# Altium project Krapong-ROV.PrjPcb
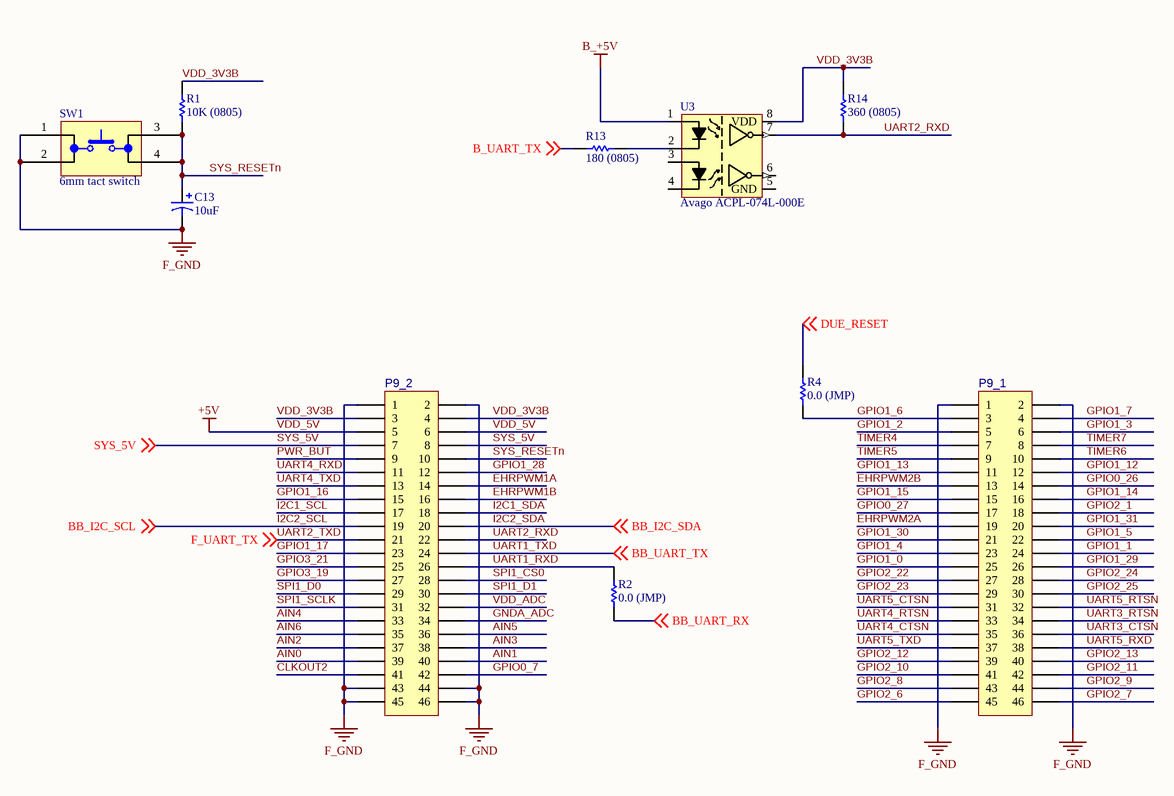
[diagram p0: BBB_Cape.SchDoc]
4 sheets, 45 parts. Net scope: global (net labels, ports and power ports of the same name join across sheets).
Sheets:
  BBB_Cape.SchDoc
  Power.SchDoc
  Interface.SchDoc
  DUE_Shield.SchDoc

## Sheet BBB_Cape.SchDoc: Krapong-ROV, F-Tube (BBB)
size A4; DocumentNumber: 1; Revision: 1.0; SheetNumber: 2; SheetTotal: 4; PageSetup: Record=PageOptions|CenterHorizontal=True|CenterVertical=True|PrintScale=0.97|XCorrection=1.00|YCorrection=1.00|PrintKind=0|BorderSize=5000000|LeftOffset=0|BottomOffset=0|Orientation=2|PaperLength=1000|PaperWidth=1000|Scale=100|PaperSource=7|PrintQuality=-3|MediaType=1|DitherType=10|PrintScaleMode=1|PaperKind=A4|PaperIndex=9; Rule: PcbType=ProtelPcb

### Parts
C13  10uF  [PCB-ibkib54e90xysjsqnert-1]
P9_1  Major League Electronics TSHC-123-D-06-240-GT-LF  [PCB-44amy4d7xro60oo8ojyx-1]  (value not drawn)
P9_2  Major League Electronics TSHC-123-D-06-240-GT-LF  [PCB-44amy4d7xro60oo8ojyx-1]  (value not drawn)
R1  10K (0805)  [RESC2013X60X40NL15T20]
R2  0.0 (JMP)  [RESC2013X60X35ML10T20]
R4  0.0 (JMP)  [RESC2013X60X35ML10T20]
R13  180 (0805)  [RESC2013X60X40NL15T20]
R14  360 (0805)  [RESC2013X60X40NL15T20]
SW1  6mm tact switch  [PCB-gaic1pl4705ifv3nefaq-1]
U3  Avago ACPL-074L-000E  [PCB-tvxoajnlj650fdg499ex-1]

### Nets
B_+5V: U3.1
F_GND: C13.2 P9_1.1 P9_1.2 P9_2.1 P9_2.2 P9_2.43 P9_2.44 P9_2.45 P9_2.46 SW1.1 SW1.2
VDD_5V: P9_2.5 P9_2.6  [also labelled +5V]
AIN0: P9_2.39
AIN1: P9_2.40
AIN2: P9_2.37
AIN3: P9_2.38
AIN4: P9_2.33
AIN5: P9_2.36
AIN6: P9_2.35
B_UART_TX: R13.2 ; off-sheet B_UART_TX
BB_UART_RX: R2.1 ; off-sheet BB_UART_RX
CLKOUT2: P9_2.41
DUE_RESET: R4.2 ; off-sheet DUE_RESET
EHRPWM1A: P9_2.14
EHRPWM1B: P9_2.16
EHRPWM2A: P9_1.19
EHRPWM2B: P9_1.13
GNDA_ADC: P9_2.34
GPIO0_7: P9_2.42
GPIO0_26: P9_1.14
GPIO0_27: P9_1.17
GPIO1_0: P9_1.25
GPIO1_1: P9_1.24
GPIO1_2: P9_1.5
GPIO1_3: P9_1.6
GPIO1_4: P9_1.23
GPIO1_5: P9_1.22
GPIO1_6: P9_1.3 R4.1
GPIO1_7: P9_1.4
GPIO1_12: P9_1.12
GPIO1_13: P9_1.11
GPIO1_14: P9_1.16
GPIO1_15: P9_1.15
GPIO1_16: P9_2.15
GPIO1_17: P9_2.23
GPIO1_28: P9_2.12
GPIO1_29: P9_1.26
GPIO1_30: P9_1.21
GPIO1_31: P9_1.20
GPIO2_1: P9_1.18
GPIO2_6: P9_1.45
GPIO2_7: P9_1.46
GPIO2_8: P9_1.43
GPIO2_9: P9_1.44
GPIO2_10: P9_1.41
GPIO2_11: P9_1.42
GPIO2_12: P9_1.39
GPIO2_13: P9_1.40
GPIO2_22: P9_1.27
GPIO2_23: P9_1.29
GPIO2_24: P9_1.28
GPIO2_25: P9_1.30
GPIO3_19: P9_2.27
GPIO3_21: P9_2.25
I2C1_SCL: P9_2.17
I2C1_SDA: P9_2.18
I2C2_SCL: P9_2.19 ; off-sheet BB_I2C_SCL  [also labelled BB_I2C_SCL]
I2C2_SDA: P9_2.20 ; off-sheet BB_I2C_SDA  [also labelled BB_I2C_SDA]
PWR_BUT: P9_2.9
SPI1_CS0: P9_2.28
SPI1_D0: P9_2.29
SPI1_D1: P9_2.30
SPI1_SCLK: P9_2.31
SYS_5V: P9_2.7 P9_2.8 ; off-sheet SYS_5V
SYS_RESETn: C13.1 P9_2.10 R1.1 SW1.3 SW1.4
TIMER4: P9_1.7
TIMER5: P9_1.9
TIMER6: P9_1.10
TIMER7: P9_1.8
UART1_RXD: P9_2.26 R2.2
UART1_TXD: P9_2.24 ; off-sheet BB_UART_TX  [also labelled BB_UART_TX]
UART2_RXD: P9_2.22 R14.2 U3.7
UART2_TXD: P9_2.21 ; off-sheet F_UART_TX  [also labelled F_UART_TX]
UART3_CTSN: P9_1.36
UART3_RTSN: P9_1.34
UART4_CTSN: P9_1.35
UART4_RTSN: P9_1.33
UART4_RXD: P9_2.11
UART4_TXD: P9_2.13
UART5_CTSN: P9_1.31
UART5_RTSN: P9_1.32
UART5_RXD: P9_1.38
UART5_TXD: P9_1.37
VDD_3V3B: P9_2.3 P9_2.4 R1.2 R14.1 U3.8(VDD)
VDD_ADC: P9_2.32
NetR13_1: R13.1 U3.2

Not connected (* = marked no-connect by the designer): U3 3 4 5(GND) 6

### Notes on the sheet
- Title
- Size:
- Date:
- A4
- Number:
- Time:
- Revision:
- Sheet
- of
- Designer:
- Siwakorn Sukprasertchai
- Marine Electrical Laboratory
- IMS, KU SRC
- File:

### Library data of the parts
C13 = CMP-da8810cd3d6e054f-2: Capacitor Alum Elec, 10uf, 100v, 20%, Capacitor Alum Elec, 10uf, 100v, 20%, Smd, Full Reel; Manufacturer Part Number: EEE-2AA100UP; Capacitance: 10.0 µF; Lead-Free Status: Lead Free; RoHS: Compliant; Octopart URL: http://octopart.com/eee-2aa100up-panasonic-55558784; Lifecycle Status: Not Listed by Manufacturer; Capacitance Tolerance: ±20%; Packaging: Cut Tape (CT); Mounting Style: Surface Mount; Size-Height: 6.20 mm; Voltage Rating (DC): 100 V; REACH SVHC Compliance: No SVHC; Size-Diameter: 8.00 mm; OctopartID: da8810cd3d6e054f
P9_1 P9_2 = CMP-5fc8970d5e37800f-3: TSHC series 46 position 2.54 mm straight Thru Hole Connector; Lead-Free Status: Lead Free; Octopart URL: http://octopart.com/tshc-123-d-06-240-gt-lf-major+league+electronics-30352537; OctopartID: 5fc8970d5e37800f; Manufacturer Part Number: TSHC-123-D-06-240-GT-LF; RoHS: Compliant
R1 R13 R14 = CMP-1860549-2: RES SMD 10K OHM 1% 1/3W 0805; Lead-Free Status: Lead Free; Power Rating: 0.125 W; Resistance: 10000.0 ?; Voltage Rating (DC): 150.0 V; Case/Package: 0805; Mounting Style: Surface Mount; Number of Pins: 2; Octopart Url: https://octopart.com/crcw080510k0fkeahp-vishay-42634554; OctopartID: fa6931e9523525ae; Packaging: Cut Tape (CT); REACH SVHC Compliance: No SVHC; Resistance Tolerance: ±1%; RoHS: Compliant
R2 R4 = CMP-1875921-8: Res Thick Film 0805 0 Ohm Molded SMD Paper T/R; Manufacturer Part Number: RC0805FR-070RL; Resistance: 0.0 ?; Lead-Free Status: Lead Free; Resistance Tolerance: ±1%; OctopartID: f3d13a5618eb2c16; Case/Package: 0805; Octopart Url: https://octopart.com/rc0805fr-070rl-yageo-9293404; Mounting Style: Surface Mount; RoHS: Compliant
SW1 = CMP-3ee8f78971b1e12f-10: Switch Tactile OFF (ON) SPST Round Button PC Pins 0.05A 24VDC 100000Cycles 1.57N Thru-Hole Loose; Manufacturer Part Number: 1825910-6; ELV Compliant: Compliant; Lead-Free Status: Lead Free; Contact Plating: Silver; Contact Material: Copper Alloy; Lifecycle Status: Active; Mounting Style: Through Hole; Octopart URL: http://octopart.com/1825910-6-te+connectivity+%2F+amp-7039551; OctopartID: 3ee8f78971b1e12f; RoHS: Compliant
U3 = CMP-ee2b274cae1231ec-3: Optocoupler Logic-Out Push-Pull DC-IN 2-CH 8-Pin SOIC Tube; Lead-Free Status: Lead Free; Output Voltage: 6.50 V; Input Current: 18.0 mA; Isolation Voltage: 3.75 kV; Number of Pins: 8; Packaging: Tube; Octopart URL: http://octopart.com/acpl-074l-000e-avago-7169375; Manufacturer Part Number: ACPL-074L-000E; REACH SVHC Compliance: No SVHC; Lifecycle Status: Active; RoHS: Compliant; Mounting Style: Surface Mount; OctopartID: ee2b274cae1231ec

## Sheet Power.SchDoc: Krapong-ROV, F-Tube (Power)
size A4; Author: Siwakorn Sukprasertchai; Engineer: Siwakorn Sukprasertchai; Organization: Author:; Address1: Siwakorn Sukprasertchai; Address3: Electrical Laboratory; Address4: IMS, KU SRC; DocumentNumber: 2; Revision: 1.0; SheetNumber: 1; SheetTotal: 4; PageSetup: Record=PageOptions|CenterHorizontal=True|CenterVertical=True|PrintScale=0.97|XCorrection=1.00|YCorrection=1.00|PrintKind=0|BorderSize=5000000|LeftOffset=0|BottomOffset=0|Orientation=2|PaperLength=1000|PaperWidth=1000|Scale=100|PaperSource=7|PrintQuality=-3|MediaType=1|DitherType=10|PrintScaleMode=1|PaperKind=A4|PaperIndex=9
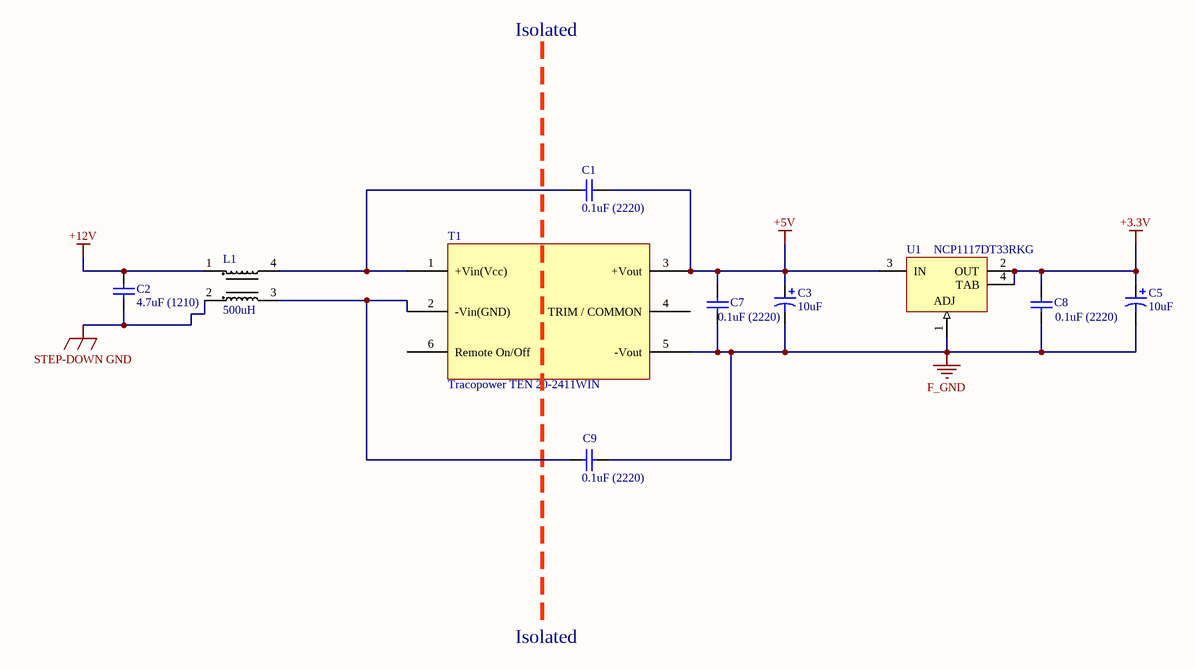
[diagram p1: Power.SchDoc]

### Parts
C1  0.1uF (2220)  [PCB-vinf2si7ml1r5i2zfsci-1]
C2  4.7uF (1210)  [PCB-2fbb0vau3p468w0y920g-1]
C3  10uF  [PCB-ibkib54e90xysjsqnert-1]
C5  10uF  [PCB-ibkib54e90xysjsqnert-1]
C7  0.1uF (2220)  [PCB-vinf2si7ml1r5i2zfsci-1]
C8  0.1uF (2220)  [PCB-vinf2si7ml1r5i2zfsci-1]
C9  0.1uF (2220)  [PCB-vinf2si7ml1r5i2zfsci-1]
L1  500uH  [PCB-kl08ucybfpyhun58dexm-1]
T1  Tracopower TEN 20-2411WIN  [PCBComponent_1]
U1  NCP1117DT33RKG  [PCB-1493942-1]

### Nets
+3.3V: C5.1 C8.1 U1.2(OUT) U1.4(TAB)
+5V: C1.1 C3.1 C7.1 T1.3(+Vout) U1.3(IN)  [project net VDD_5V]
+12V: C2.2 L1.1
F_GND: C3.2 C5.2 C7.2 C8.2 C9.1 T1.5(-Vout) U1.1(ADJ)
STEP-DOWN GND: C2.1 L1.2  [project net -PWL (0V)]
NetC1_2: C1.2 L1.4 T1.1(+Vin(Vcc))
NetC9_2: C9.2 L1.3 T1.2(-Vin(GND))

Not connected (* = marked no-connect by the designer): T1 4(TRIM_/_COMMON) 6(Remote_On/Off)

### Notes on the sheet
- Isolated
- Title
- Size:
- Date:
- A4
- Number:
- Time:
- Revision:
- Sheet
- of
- Designer:
- Siwakorn Sukprasertchai
- Marine Electrical Laboratory
- IMS, KU SRC
- File:

### Library data of the parts
C1 C7-C9 = CMP-869a4f93a212595d-3: 2220 1 uF 250 V ±10% Tolerance X7R SMT Multilayer Ceramic Capacitor; Manufacturer Part Number: GRM55DR72E105KW01L; Voltage Rating (DC): 250.0 V; Capacitance: 1e-06 F; Lead-Free Status: Lead Free; Mounting Style: Surface Mount; Dielectric Characteristic: X7R; Number of Pins: 2; Digikey URL: http://www.digikey.com/product-detail/en/murata-electronics-north-america/GRM55DR72E105KW01L/490-3550-1-ND/789455; Size-Width: 0.005 m; Case/Package: 2220, 5750; REACH SVHC Compliance: No SVHC; Size-Height: 0.002 m; Packaging: Cut Tape (CT), Tape & Reel (TR); Capacitance Tolerance: ±10%; RoHS: Compliant; OctopartID: 869a4f93a212595d; Size-Length: 0.0057 m; Octopart URL: http://octopart.com/grm55dr72e105kw01l-murata-197102
C2 = Murata GRM32ER71H475KA88L-1: 1210 4.7 uF 50 V ±10% Tolerance X7R SMT Multilayer Ceramic Capacitor; Voltage Rating (DC): 50.0 V; Lead-Free Status: Lead Free; Capacitance: 4.7e-06 F; Case/Package (SI): 3225; Octopart URL: http://octopart.com/grm32er71h475ka88l-murata-196576; Manufacturer Part Number: GRM32ER71H475KA88L; Size-Height: 0.0025 m; Dielectric Characteristic: X7R; Size-Width: 0.0025 m; RoHS: Compliant; REACH SVHC Compliance: No SVHC; Mounting Style: Surface Mount; Capacitance Tolerance: ±10%; Packaging: Cut Tape (CT), Tape & Reel (TR); Size-Length: 0.0032 m; Size-Thickness: 0.0025 m; Lifecycle Status: Active; Case/Package: 1210; Number of Pins: 2; OctopartID: 8d884480570e524f
C3 C5 = CMP-da8810cd3d6e054f-2: as C13 on sheet BBB_Cape; RoHS: Compliant; Octopart URL: http://octopart.com/eee-2aa100up-panasonic-55558784; Lifecycle Status: Not Listed by Manufacturer; Capacitance Tolerance: ±20%; Packaging: Cut Tape (CT); Mounting Style: Surface Mount; Size-Height: 6.20 mm; Voltage Rating (DC): 100 V; REACH SVHC Compliance: No SVHC; Size-Diameter: 8.00 mm; OctopartID: da8810cd3d6e054f
L1 = CMP-c51a0edc807c1add-4: Common Mode Chokes Dual 1mH 10kHz 15A 3.3mOhm DCR Thru-Hole T/R; Manufacturer Part Number: 7448031501; Inductance: 1.00 mH; RoHS: Compliant; REACH SVHC Compliance: No SVHC; Mounting Style: Through Hole; Packaging: Bulk
T1 = CMP-cff406adefdb1033-7: 20 W Watt, 9-36VDCVin, Quad Output, 5V@4A General Purpose DC-DC Converter in standard 1 x 2; Isolation Voltage: 1.50 kV; Output Voltage: 5.00 V; Supply Voltage (DC): 24.0 V; Power Rating: 20.0 W; Number of Outputs: 1; Input Voltage (DC): 9.00 V to 36.0 V; Output Current: 4.00 A; Size-Width: 25.4 mm; Octopart URL: http://octopart.com/ten+20-2411win-tracopower-5440841; Manufacturer Part Number: TEN 20-2411WIN; OctopartID: cff406adefdb1033; Size-Height: 10.2 mm; REACH SVHC Compliance: No SVHC; Mounting Style: Through Hole; RoHS: Compliant
U1 = CMP-1493942-4: IC REG LDO 3.3V 1A DPAK; Current Rating: 1.0 A; Dropout Voltage: 1.2 V; Polarity: P-Channel; Number of Outputs: 1; Lead-Free Status: Lead Free; Mounting Style: Surface Mount; RoHS: Compliant; Octopart Url: https://octopart.com/ncp1117dt33rkg-on+semiconductor-538097; Case/Package: DPAK; OctopartID: 07a0cea21737d867; REACH SVHC Compliance: No SVHC; Lifecycle Status: Active; Number of Pins: 3; Packaging: Cut Tape (CT); Output Voltage: 3.3 V; Output Current: 1.0 A; Halogen Free Status: Halogen Free

## Sheet Interface.SchDoc: Krapong-ROV, F-Tube (Sensor, Interface)
size A4; DocumentNumber: 3; SheetNumber: 4; SheetTotal: 4; PageSetup: Record=PageOptions|CenterHorizontal=True|CenterVertical=True|PrintScale=0.97|XCorrection=1.00|YCorrection=1.00|PrintKind=0|BorderSize=5000000|LeftOffset=0|BottomOffset=0|Orientation=2|PaperLength=1000|PaperWidth=1000|Scale=100|PaperSource=7|PrintQuality=-3|MediaType=1|DitherType=10|PrintScaleMode=1|PaperKind=A4|PaperIndex=9
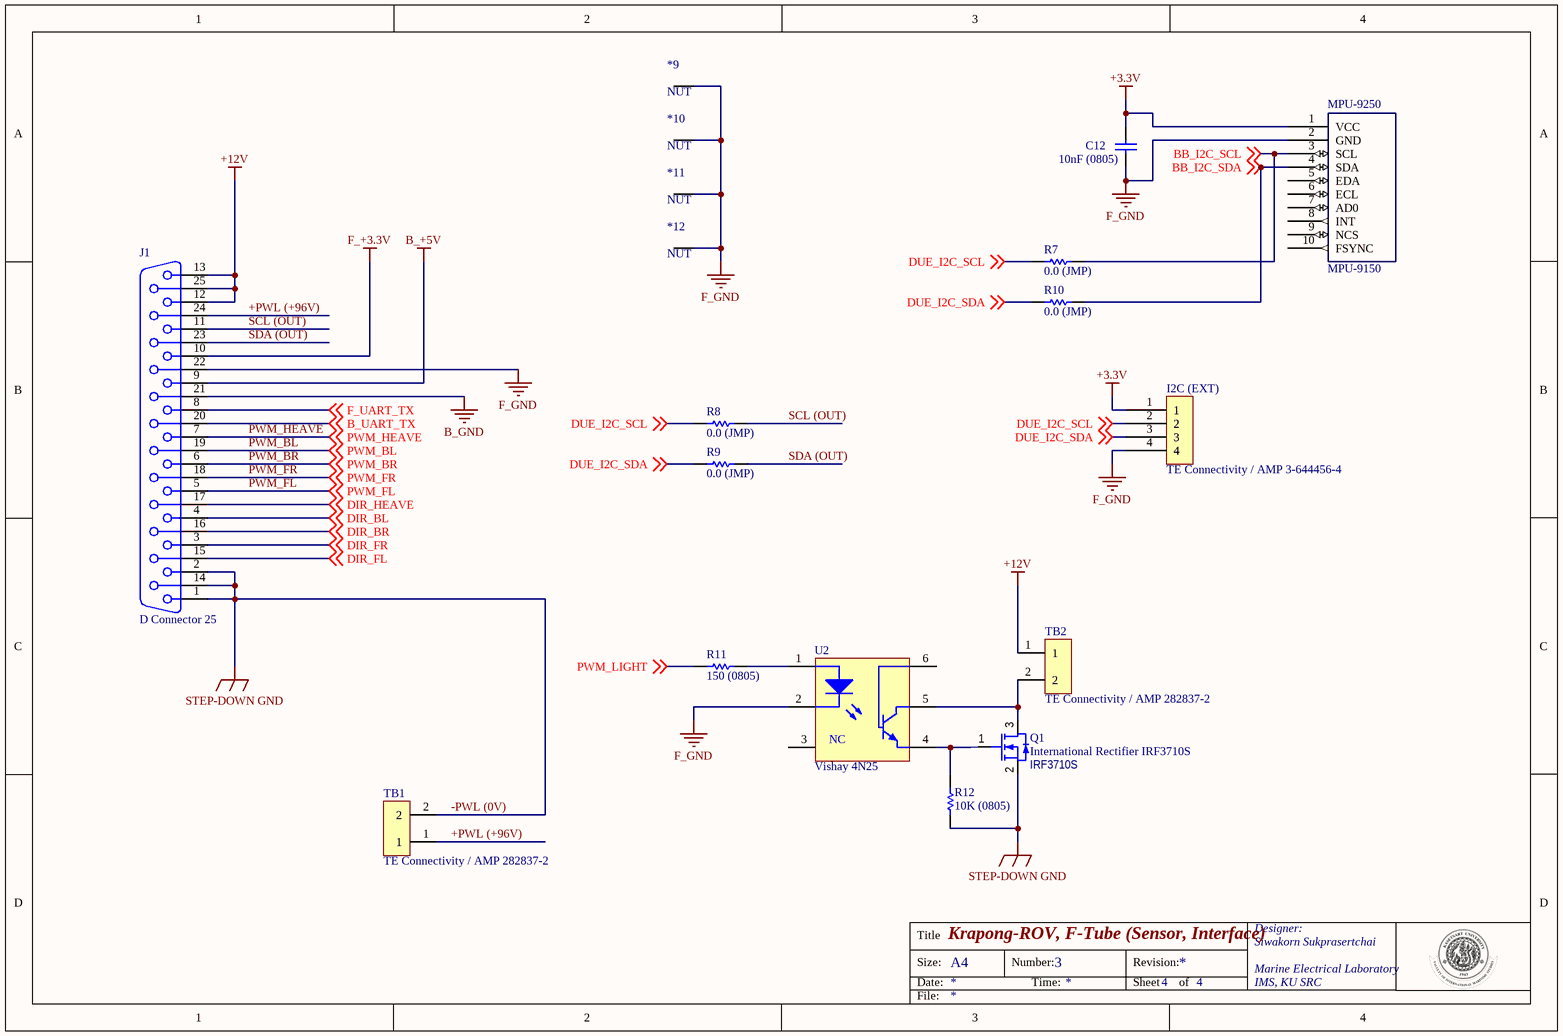
[diagram p2: Interface.SchDoc]

### Parts
*9  NUT  [PCB-pcj1l6roq5gpi9u538ps-1]
*10  NUT  [PCB-pcj1l6roq5gpi9u538ps-1]
*11  NUT  [PCB-pcj1l6roq5gpi9u538ps-1]
*12  NUT  [PCB-pcj1l6roq5gpi9u538ps-1]
C12  10nF (0805)  [CAPC2013X94X50NL20T25]
I2C_(EXT)  TE Connectivity / AMP 3-644456-4  [PCB-rz6n0fnwkrymh4bzf5j3-1]
J1  D Connector 25  [PCB-w6wyndea0hgjvu195v0z-1]
MPU-9250  MPU-9150  [PCB-qjnj89ydof8zhvyyt2pp-1]
Q1  International Rectifier IRF3710S  Vlaue: IRF3710S  [PCB-knfcvcmaqkz1jt91xuml-1]
R7  0.0 (JMP)  [RESC2013X60X35ML10T20]
R8  0.0 (JMP)  [RESC2013X60X35ML10T20]
R9  0.0 (JMP)  [RESC2013X60X35ML10T20]
R10  0.0 (JMP)  [RESC2013X60X35ML10T20]
R11  150 (0805)  [RESC2013X60X40NL15T20]
R12  10K (0805)  [RESC2013X60X40NL15T20]
TB1  TE Connectivity / AMP 282837-2  [PCB-suk0edwv8aq1tcw7107x-1]
TB2  TE Connectivity / AMP 282837-2  [PCB-suk0edwv8aq1tcw7107x-1]
U2  Vishay 4N25  [PCB-jnahbn6qvly565f94r9b-1]

### Nets
+3.3V: C12.2 I2C_(EXT).1 MPU-9250.1(VCC)
+12V: J1.12 J1.13 J1.25 TB2.1
-PWL (0V): J1.1 J1.2 J1.14 Q1.2(S) R12.1 TB1.2  [also labelled STEP-DOWN GND]
B_+5V: J1.9
B_GND: J1.21
F_+3.3V: J1.10
F_GND: *9.0 *10.0 *11.0 *12.0 C12.1 I2C_(EXT).4 J1.22 MPU-9250.2(GND) U2.2
+PWL (+96V): J1.24 TB1.1
B_UART_TX: J1.20 ; off-sheet B_UART_TX
BB_I2C_SCL: MPU-9250.3(SCL) R7.1 ; off-sheet BB_I2C_SCL  [project net I2C2_SCL]
BB_I2C_SDA: MPU-9250.4(SDA) R10.1 ; off-sheet BB_I2C_SDA  [project net I2C2_SDA]
DIR_BL: J1.4 ; off-sheet DIR_BL
DIR_BR: J1.16 ; off-sheet DIR_BR
DIR_FL: J1.15 ; off-sheet DIR_FL
DIR_FR: J1.3 ; off-sheet DIR_FR
DIR_HEAVE: J1.17 ; off-sheet DIR_HEAVE
DUE_I2C_SCL: I2C_(EXT).2 R7.2 R8.2 ; off-sheet DUE_I2C_SCL
DUE_I2C_SDA: I2C_(EXT).3 R9.2 R10.2 ; off-sheet DUE_I2C_SDA
F_UART_TX: J1.8 ; off-sheet F_UART_TX  [project net UART2_TXD]
PWM_BL: J1.19 ; off-sheet PWM_BL
PWM_BR: J1.6 ; off-sheet PWM_BR
PWM_FL: J1.5 ; off-sheet PWM_FL
PWM_FR: J1.18 ; off-sheet PWM_FR
PWM_HEAVE: J1.7 ; off-sheet PWM_HEAVE
PWM_LIGHT: R11.2 ; off-sheet PWM_LIGHT
SCL (OUT): J1.11 R8.1
SDA (OUT): J1.23 R9.1
NetQ1_1: Q1.1(G) R12.2 U2.4
NetQ1_3: Q1.3(D) TB2.2 U2.5
NetR11_1: R11.1 U2.1

Not connected (* = marked no-connect by the designer): MPU-9250 5(EDA) 6(ECL) 7(AD0) 8(INT) 9(NCS) 10(FSYNC); U2 3 6

### Notes on the sheet
- Title
- Size:
- Date:
- A4
- Number:
- Time:
- Revision:
- Sheet
- of
- Designer:
- Siwakorn Sukprasertchai
- Marine Electrical Laboratory
- IMS, KU SRC
- File:
- (in symbol CMP-1524877-3) NC

### Library data of the parts
*9-*12 = CMP-5ddc94dc62be821b-2: Standoff; 12 mm; M3 x 0.5; Brass; Hex; Nickel Plate; 8 in.; 8 in.; Manufacturer Part Number: 24314; Lead-Free Status: Lead Free; Size-Width: 5.00 mm; Octopart URL: http://octopart.com/24314-keystone-662020; OctopartID: 5ddc94dc62be821b; Size-Length: 12.0 mm; Material: Brass; RoHS: Compliant
C12 = CMP-16466678-5: CAP CER 10NF 50V 5% X7R 0805; Manufacturer Part Number: 08055C103JAT2A; Case/Package (SI): 2012; Capacitance: 1e-08 F; Voltage Rating (DC): 50.0 V; Dielectric Material: Ceramic Multilayer; Lead-Free Status: Lead Free; Insulation Resistance: 1e+11 ?; Size-Width: 0.0012446 m; REACH SVHC Compliance: No SVHC; Capacitance Tolerance: ±5%; Case/Package: 0805; Mounting Style: Surface Mount; Size-Thickness: 0.0009398 m; Dielectric Characteristic: X7R; Octopart Url: https://octopart.com/08055c103jat2a-avx+interconnect+%2F+elco-39513106; Size-Height: 0.00094 m; Size-Length: 0.0020066 m; Number of Pins: 2; RoHS: Compliant; OctopartID: 02fac9aacb8edd3d
I2C_(EXT) = CMP-aedf658f79ea7118-2: Board-To-Board Connector, MTA-100 Series, Through Hole, Header, 4, 2.54 mm, Tin Plated Contacts; Gender: Male; Pin Pitch: 2.54 mm; Number of Positions: 4; Shrouded: No; Lead-Free Status: Lead Free; Voltage Rating (AC): 250 V; Mounting Angle: 180 °; ELV Compliant: Compliant; Size-Width: 2.34 mm; Number of Rows: 1; Housing Material: Polyester; Flammability Rating: UL 94 V-0; Contact Material: Copper Alloy; Octopart URL: http://octopart.com/3-644456-4-te+connectivity+%2F+amp-39514707; Contact Plating: Tin; Mounting Style: Through Hole; Number of Contacts: 4; Manufacturer Part Number: 3-644456-4; Lifecycle Status: Active; Housing Color: Natural; RoHS: Compliant; Size-Length: 9.86 mm; Orientation: Vertical; OctopartID: aedf658f79ea7118; Size-Height: 2.54 mm; Packaging: Box, Bag
J1 = CMP-d8a713f745850760-3: D Sub Connector, Amplimite HD-20, Amplimite HD-20 Series, DB, Plug, 25, Metal, Solder; Manufacturer Part Number: 5747842-4; ELV Compliant: Compliant; Gender: Male; Lead-Free Status: Lead Free; Pin Pitch: 2.77 mm; Number of Contacts: 25; Orientation: Right Angle; Packaging: Tray; Housing Color: Black; Mounting Style: Through Hole; RoHS: Compliant; Lifecycle Status: Active; Size-Length: 53.0 mm; Color: Black; Contact Plating: Gold over Nickel; OctopartID: d8a713f745850760; Contact Material: Brass; Number of Rows: 2; Size-Height: 12.6 mm; Housing Material: Nylon; Octopart URL: http://octopart.com/5747842-4-te+connectivity+%2F+amp-39499844; REACH SVHC Compliance: No SVHC; Material: Steel; Flammability Rating: UL 94 V-0; Number of Positions: 25; Size-Width: 18.7 mm
MPU-9250 = CMP-arxnhq8o6hyvnzrq5u03-1: MPU-9150 or GY-Series; CustomComponentID: arxnhq8o6hyvnzrq5u03
Q1 = CMP-3cf2f5f9d0cee335-1: 100V Single N-Channel HEXFET Power MOSFET in a D2-Pak package; Breakdown Voltage (Drain to Source): 100 V (min); Current Rating: 57.0 A; Lead-Free Status: Contains Lead; Rise Time: 58.0 ns; Drain to Source Resistance (on) (Rds): 23.0 m? (max); Power Dissipation: 3.80 W; Octopart URL: http://octopart.com/irf3710s-international+rectifier-117082; Manufacturer Part Number: IRF3710S; Polarity: N-Channel; Voltage Rating (DC): 100 V; Part Family: IRF3710S; Drain to Source Voltage (Vds): 100 V; Mounting Style: Surface Mount; Packaging: Bulk; Lifecycle Status: Pending Obsolescence; RoHS: Non-Compliant; Continuous Drain Current (Ids): 57.0 A; OctopartID: 3cf2f5f9d0cee335
R7-R10 = CMP-1875921-8: as R2 on sheet BBB_Cape; OctopartID: f3d13a5618eb2c16; Case/Package: 0805; Octopart Url: https://octopart.com/rc0805fr-070rl-yageo-9293404; Mounting Style: Surface Mount; RoHS: Compliant
R11 R12 = CMP-1860549-2: as R1 on sheet BBB_Cape; Case/Package: 0805; Mounting Style: Surface Mount; Number of Pins: 2; Octopart Url: https://octopart.com/crcw080510k0fkeahp-vishay-42634554; OctopartID: fa6931e9523525ae; Packaging: Cut Tape (CT); REACH SVHC Compliance: No SVHC; Resistance Tolerance: ±1%; RoHS: Compliant
TB1 TB2 = CMP-50ff9bac89d88f38-13: Connector Terminal Blocks Receptacle 2 Position 5.08mm Solder Straight Thru-Hole 13.5A/Contact; Number of Contacts: 2; ELV Compliant: Compliant; Lead-Free Status: Lead Free; Voltage Rating (AC): 250 V; Lifecycle Status: Active; Contact Material: Brass; OctopartID: ced9058a17fd111e; Packaging: Bulk; Mounting Style: PC Board, PCB; Octopart URL: http://octopart.com/282837-2-te+connectivity+%2F+amp-39451714; Flammability Rating: UL 94 V-0; Orientation: Right Angle; Housing Material: Nylon 6/6; Color: Green; RoHS: Compliant; Housing Color: Green; Number of Positions: 2; Contact Plating: Tin; Manufacturer Part Number: 282837-2
U2 = CMP-1524877-3: 1 Channel Transistor Output Optocoupler 1 Channel Transistor Output Optocoupler; Lead-Free Status: Lead Free; Isolation Voltage: 600 V; Input Current: 50.0 mA; Output Voltage: 30.0 V; Rise Time: 3.00 µs; Input Voltage (DC): 1.20 V; Number of Circuits: 1; Octopart URL: http://octopart.com/4n25-vishay-55433896; Manufacturer Part Number: 4N25; RoHS: Compliant; Mounting Style: Through Hole; Packaging: Tube; Number of Pins: 6; Case/Package: DIP; Number of Channels: 1; OctopartID: 1bb3d1f4e47dc474

## Sheet DUE_Shield.SchDoc: Krapong-ROV, F-Tube (DUE)
size A4; DocumentNumber: 4; SheetNumber: 3; SheetTotal: 4; PageSetup: Record=PageOptions|CenterHorizontal=True|CenterVertical=True|PrintScale=0.97|XCorrection=1.00|YCorrection=1.00|PrintKind=0|BorderSize=5000000|LeftOffset=0|BottomOffset=0|Orientation=2|PaperLength=1000|PaperWidth=1000|Scale=100|PaperSource=7|PrintQuality=-3|MediaType=1|DitherType=10|PrintScaleMode=1|PaperKind=A4|PaperIndex=9
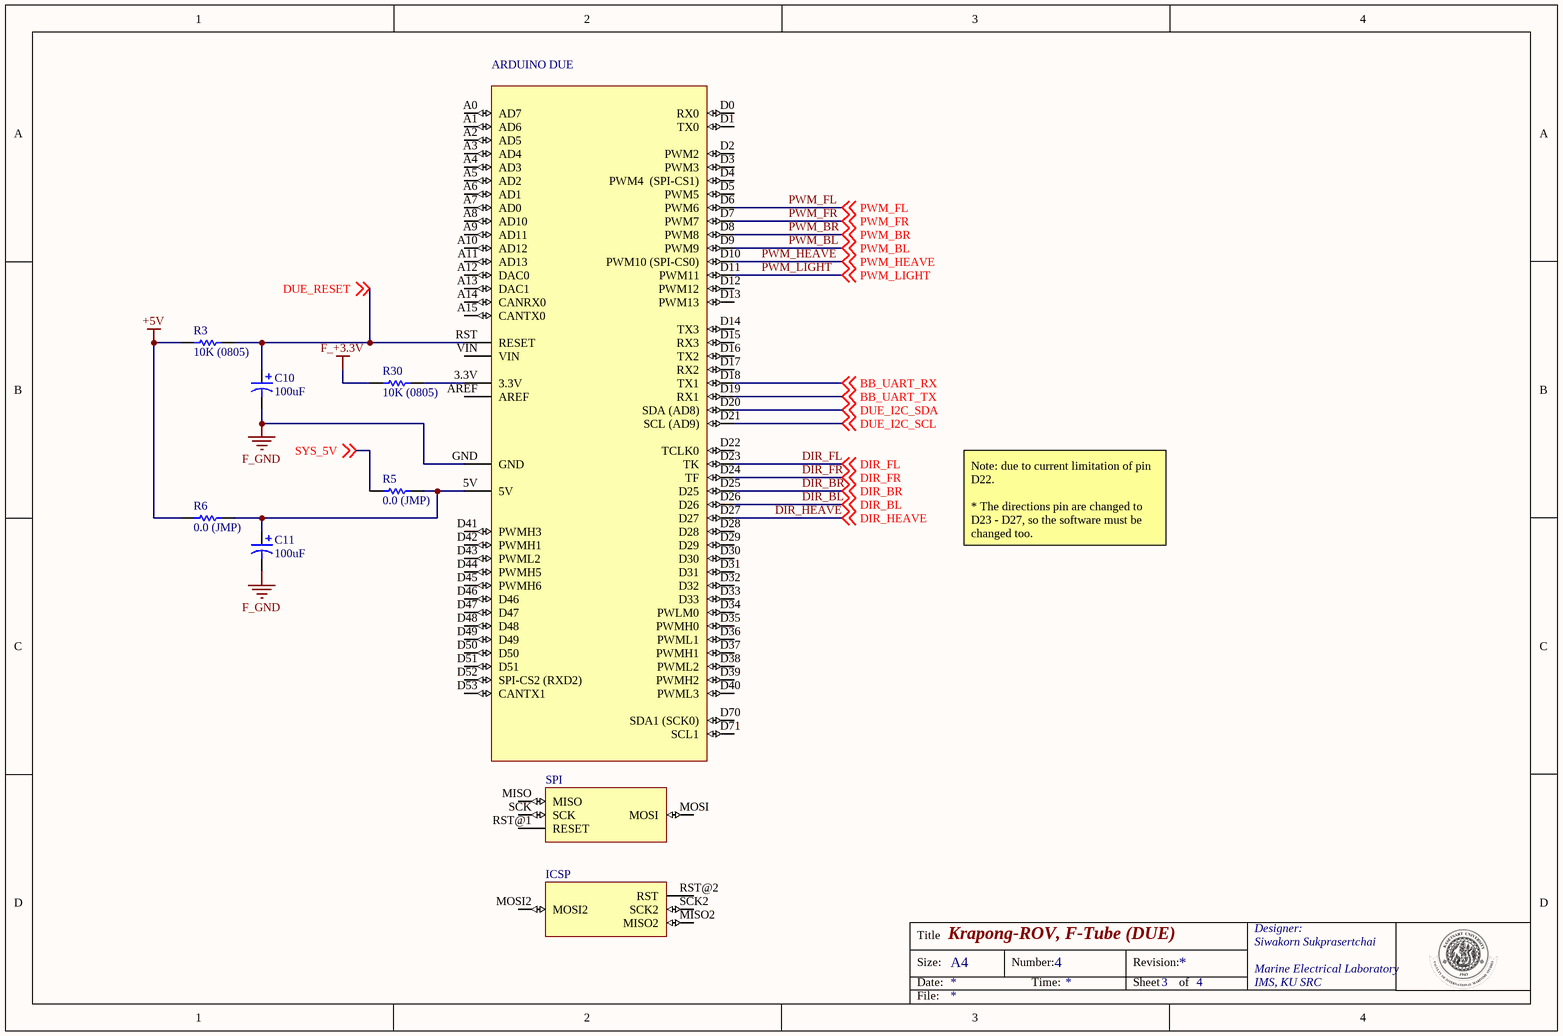
[diagram p3: DUE_Shield.SchDoc]

### Parts
C10  100uF  [PCB-ec5i0bi6g8n3i6bd77c9-1]
C11  100uF  [PCB-ibkib54e90xysjsqnert-1]
DUE  arduino due schematic and base pcb to top  [PCB-973053-1]  (value not drawn)
R3  10K (0805)  [RESC2013X60X40NL15T20]
R5  0.0 (JMP)  [RESC2013X60X35ML10T20]
R6  0.0 (JMP)  [RESC2013X60X35ML10T20]
R30  10K (0805)  [RESC2013X60X40NL15T20]

### Nets
+5V: R3.1 R6.1  [project net VDD_5V]
F_+3.3V: R30.1
F_GND: C10.2 C11.2 DUE.GND
BB_UART_RX: DUE.D18(TX1) ; off-sheet BB_UART_RX
BB_UART_TX: DUE.D19(RX1) ; off-sheet BB_UART_TX  [project net UART1_TXD]
DIR_BL: DUE.D26 ; off-sheet DIR_BL
DIR_BR: DUE.D25 ; off-sheet DIR_BR
DIR_FL: DUE.D23(TK) ; off-sheet DIR_FL
DIR_FR: DUE.D24(TF) ; off-sheet DIR_FR
DIR_HEAVE: DUE.D27 ; off-sheet DIR_HEAVE
DUE_I2C_SCL: DUE.D21(SCL_(AD9)) ; off-sheet DUE_I2C_SCL
DUE_I2C_SDA: DUE.D20(SDA_(AD8)) ; off-sheet DUE_I2C_SDA
DUE_RESET: C10.1 DUE.RST(RESET) R3.2 ; off-sheet DUE_RESET
PWM_BL: DUE.D9(PWM9) ; off-sheet PWM_BL
PWM_BR: DUE.D8(PWM8) ; off-sheet PWM_BR
PWM_FL: DUE.D6(PWM6) ; off-sheet PWM_FL
PWM_FR: DUE.D7(PWM7) ; off-sheet PWM_FR
PWM_HEAVE: DUE.D10(PWM10_(SPI-CS0)) ; off-sheet PWM_HEAVE
PWM_LIGHT: DUE.D11(PWM11) ; off-sheet PWM_LIGHT
SYS_5V: R5.1 ; off-sheet SYS_5V
NetC11_1: C11.1 DUE.5V R5.2 R6.2
NetDUE_3.3V: DUE.3.3V R30.2

Not connected (* = marked no-connect by the designer): DUE A0(AD7) A1(AD6) A2(AD5) A3(AD4) A4(AD3) A5(AD2) A6(AD1) A7(AD0) A8(AD10) A9(AD11) A10(AD12) A11(AD13) A12(DAC0) A13(DAC1) A14(CANRX0) A15(CANTX0) AREF D0(RX0) D1(TX0) D2(PWM2) D3(PWM3) D4(PWM4__(SPI-CS1)) D5(PWM5) D12(PWM12) D13(PWM13) D14(TX3) D15(RX3) D16(TX2) D17(RX2) D22(TCLK0) D28 D29 D30 D31 D32 D33 D34(PWLM0) D35(PWMH0) D36(PWML1) D37(PWMH1) D38(PWML2) D39(PWMH2) D40(PWML3) D41(PWMH3) D42(PWMH1) D43(PWML2) D44(PWMH5) D45(PWMH6) D46 D47 D48 D49 D50 D51 D52(SPI-CS2_(RXD2)) D53(CANTX1) D70(SDA1_(SCK0)) D71(SCL1) MISO MISO2 MOSI MOSI2 RST@1(RESET) RST@2(RST) SCK SCK2 VIN

### Notes on the sheet
- Note: due to current limitation of pin D22.
  * The directions pin are changed to D23 - D27, so the software must be changed too.
- Title
- Size:
- Date:
- A4
- Number:
- Time:
- Revision:
- Sheet
- of
- Designer:
- Siwakorn Sukprasertchai
- Marine Electrical Laboratory
- IMS, KU SRC
- File:
- (in symbol CMP-973053-32) ARDUINO DUE; SPI; ICSP

### Library data of the parts
C10 = CMP-42da8bd37ecc9d1d-1: WX Series 100 uF 25 V ±20 % Surface Mount Chip Aluminum Electrolytic Capacitor; Manufacturer Part Number: UWX1E101MCL1GB; Voltage Rating (DC): 25.0 V; Lead-Free Status: Lead Free; Capacitance: 100 µF; Capacitance Tolerance: ±20%; Octopart URL: http://octopart.com/uwx1e101mcl1gb-nichicon-203120; Size-Length: 5.40 mm; Size-Height: 5.40 mm; RoHS: Compliant; Mounting Style: Surface Mount; Dielectric Material: Aluminum Electrolytic; Packaging: Tape & Reel (TR), Cut Tape (CT); Number of Pins: 2; Size-Diameter: 8.00 mm; OctopartID: 42da8bd37ecc9d1d
C11 = CMP-da8810cd3d6e054f-2: Capacitor Alum Elec, 10uf, 100v, 20%, Capacitor Alum Elec, 10uf, 100v, 20%, Smd, Full Reel; Manufacturer Part Number: EEE-2AA100UP; Lead-Free Status: Lead Free; Capacitance: 10.0 µF; REACH SVHC Compliance: No SVHC; Voltage Rating (DC): 100 V; Lifecycle Status: Not Listed by Manufacturer; RoHS: Compliant; Size-Height: 6.20 mm; Octopart URL: http://octopart.com/eee-2aa100up-panasonic-55558784; Size-Diameter: 8.00 mm; OctopartID: da8810cd3d6e054f; Packaging: Cut Tape (CT); Capacitance Tolerance: ±20%; Mounting Style: Surface Mount
DUE = CMP-973053-32: ARDUINO DUE schematic and base pcb; ADC Channels: YES; Supply Voltage-Nom (Vsup) (V): 5; Microcontroller Type: RISC MICROCONTROLLER; Clock/Crystal Freq-Max (fclk) (MHz): 16; CiivaID: 973053; Package Body Material: PLASTIC/EPOXY; DAC Channels: NO; Number of I/O Lines: 86; Bit Size: 8; Time@Peak Reflow Temperature-Max (s): 40; Supply Voltage-Max (Vsup) (V): 5.5; Supply Voltage-Min (Vsup) (V): 4.5; Additional Feature: OPERATES AT 2.7V MINIMUM SUPPLY @ 8 MHZ; ROM Programmability: FLASH; Width (mm): 14; Package Code: TFQFP; Technology: CMOS; Surface Mount: YES; Operating Temperature-Max (Cel): 85; Number of Terminals: 100; Terminal Position: QUAD; Moisture Sensitivity Level: 3; Lead Free: YES; Seated Height-Max (mm): 1.2; Terminal Finish: MATTE TIN; Temperature Grade: INDUSTRIAL; Peak Reflow Temperature (Cel): 260; External Data Bus Width: 8; Terminal Form: GULL WING; PWM Channels: YES; JESD-30 Code: S-PQFP-G100; Operating Temperature-Min (Cel): -40; JESD-97 Code: e3; Speed (MHz): 16; Package Shape: SQUARE; Address Bus Width (bits): 16; Package Style: FLATPACK, THIN PROFILE, FINE PITCH; DMA Channels: NO; Terminal Pitch (mm): 0.5; Length (mm): 14
R3 R30 = CMP-1860549-2: as R1 on sheet BBB_Cape; Case/Package: 0805; Mounting Style: Surface Mount; Number of Pins: 2; Octopart Url: https://octopart.com/crcw080510k0fkeahp-vishay-42634554; OctopartID: fa6931e9523525ae; Packaging: Cut Tape (CT); REACH SVHC Compliance: No SVHC; Resistance Tolerance: ±1%; RoHS: Compliant
R5 R6 = CMP-1875921-8: as R2 on sheet BBB_Cape; OctopartID: f3d13a5618eb2c16; Case/Package: 0805; Octopart Url: https://octopart.com/rc0805fr-070rl-yageo-9293404; Mounting Style: Surface Mount; RoHS: Compliant

## Nets that join several sheets
+3.3V: Power (C5.1 C8.1 U1.2 U1.4), Interface (C12.2 I2C_(EXT).1 MPU-9250.1)
+12V: Power (C2.2 L1.1), Interface (J1.12 J1.13 J1.25 TB2.1)
-PWL (0V): Power (C2.1 L1.2), Interface (6 pins)
B_+5V: BBB_Cape (U3.1), Interface (J1.9)
F_+3.3V: Interface (J1.10), DUE_Shield (R30.1)
F_GND: BBB_Cape (11 pins), Power (7 pins), Interface (9 pins), DUE_Shield (C10.2 C11.2 DUE.GND)
VDD_5V: BBB_Cape (P9_2.5 P9_2.6), Power (5 pins), DUE_Shield (R3.1 R6.1)
B_UART_TX: BBB_Cape (R13.2), Interface (J1.20)
BB_UART_RX: BBB_Cape (R2.1), DUE_Shield (DUE.D18)
DIR_BL: Interface (J1.4), DUE_Shield (DUE.D26)
DIR_BR: Interface (J1.16), DUE_Shield (DUE.D25)
DIR_FL: Interface (J1.15), DUE_Shield (DUE.D23)
DIR_FR: Interface (J1.3), DUE_Shield (DUE.D24)
DIR_HEAVE: Interface (J1.17), DUE_Shield (DUE.D27)
DUE_I2C_SCL: Interface (I2C_(EXT).2 R7.2 R8.2), DUE_Shield (DUE.D21)
DUE_I2C_SDA: Interface (I2C_(EXT).3 R9.2 R10.2), DUE_Shield (DUE.D20)
DUE_RESET: BBB_Cape (R4.2), DUE_Shield (C10.1 DUE.RST R3.2)
I2C2_SCL: BBB_Cape (P9_2.19), Interface (MPU-9250.3 R7.1)
I2C2_SDA: BBB_Cape (P9_2.20), Interface (MPU-9250.4 R10.1)
PWM_BL: Interface (J1.19), DUE_Shield (DUE.D9)
PWM_BR: Interface (J1.6), DUE_Shield (DUE.D8)
PWM_FL: Interface (J1.5), DUE_Shield (DUE.D6)
PWM_FR: Interface (J1.18), DUE_Shield (DUE.D7)
PWM_HEAVE: Interface (J1.7), DUE_Shield (DUE.D10)
PWM_LIGHT: Interface (R11.2), DUE_Shield (DUE.D11)
SYS_5V: BBB_Cape (P9_2.7 P9_2.8), DUE_Shield (R5.1)
UART1_TXD: BBB_Cape (P9_2.24), DUE_Shield (DUE.D19)
UART2_TXD: BBB_Cape (P9_2.21), Interface (J1.8)